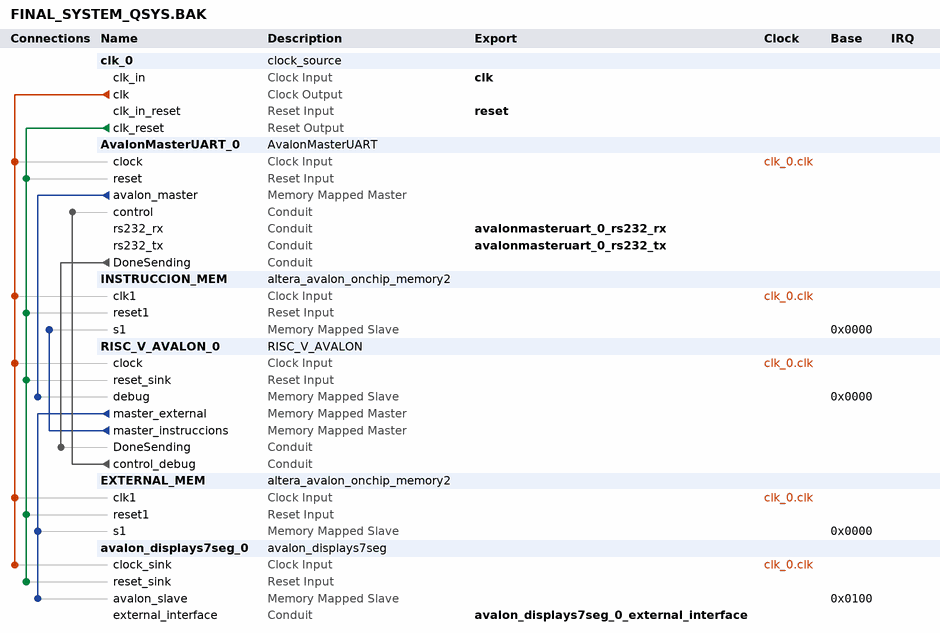
[diagram p0: system contents]
# Platform Designer (Qsys) system FINAL_SYSTEM_QSYS.BAK, Cyclone IV E EP4CE115F29C7
# Parameters at their usual value, and those the tool derives, are not listed.
package require -exact qsys 17.1
create_system FINAL_SYSTEM_QSYS.BAK
set_project_property DEVICE_FAMILY {Cyclone IV E}
set_project_property DEVICE EP4CE115F29C7

add_instance clk_0 clock_source 17.1
set_instance_parameter_value clk_0 clockFrequency 50000000

add_instance AvalonMasterUART_0 AvalonMasterUART 3.0
set_instance_parameter_value AvalonMasterUART_0 c_CLKS_PER_BIT 434

add_instance INSTRUCCION_MEM altera_avalon_onchip_memory2 17.1
set_instance_parameter_value INSTRUCCION_MEM dataWidth 32
set_instance_parameter_value INSTRUCCION_MEM dualPort false
set_instance_parameter_value INSTRUCCION_MEM initMemContent true
set_instance_parameter_value INSTRUCCION_MEM initializationFileName onchip_mem.hex
set_instance_parameter_value INSTRUCCION_MEM memorySize 256

add_instance RISC_V_AVALON_0 RISC_V_AVALON 3.0

add_instance EXTERNAL_MEM altera_avalon_onchip_memory2 17.1
set_instance_parameter_value EXTERNAL_MEM dataWidth 32
set_instance_parameter_value EXTERNAL_MEM dualPort false
set_instance_parameter_value EXTERNAL_MEM initMemContent true
set_instance_parameter_value EXTERNAL_MEM initializationFileName onchip_mem.hex
set_instance_parameter_value EXTERNAL_MEM memorySize 256

add_instance avalon_displays7seg_0 avalon_displays7seg 1.0
set_instance_parameter_value avalon_displays7seg_0 invert 0

# connections
add_connection clk_0.clk avalon_displays7seg_0.clock_sink clock
add_connection clk_0.clk AvalonMasterUART_0.clock clock
add_connection clk_0.clk EXTERNAL_MEM.clk1 clock
add_connection clk_0.clk INSTRUCCION_MEM.clk1 clock
add_connection clk_0.clk RISC_V_AVALON_0.clock clock
add_connection clk_0.clk_reset avalon_displays7seg_0.reset_sink reset
add_connection clk_0.clk_reset AvalonMasterUART_0.reset reset
add_connection clk_0.clk_reset EXTERNAL_MEM.reset1 reset
add_connection clk_0.clk_reset INSTRUCCION_MEM.reset1 reset
add_connection clk_0.clk_reset RISC_V_AVALON_0.reset_sink reset
add_connection AvalonMasterUART_0.avalon_master RISC_V_AVALON_0.debug avalon
set_connection_parameter_value AvalonMasterUART_0.avalon_master/RISC_V_AVALON_0.debug baseAddress 0x0000
add_connection RISC_V_AVALON_0.master_external avalon_displays7seg_0.avalon_slave avalon
set_connection_parameter_value RISC_V_AVALON_0.master_external/avalon_displays7seg_0.avalon_slave baseAddress 0x0100
add_connection RISC_V_AVALON_0.master_external EXTERNAL_MEM.s1 avalon
set_connection_parameter_value RISC_V_AVALON_0.master_external/EXTERNAL_MEM.s1 baseAddress 0x0000
add_connection RISC_V_AVALON_0.master_instruccions INSTRUCCION_MEM.s1 avalon
set_connection_parameter_value RISC_V_AVALON_0.master_instruccions/INSTRUCCION_MEM.s1 baseAddress 0x0000
add_connection AvalonMasterUART_0.DoneSending RISC_V_AVALON_0.DoneSending conduit
add_connection RISC_V_AVALON_0.control_debug AvalonMasterUART_0.control conduit

# exported interfaces
add_interface avalon_displays7seg_0_external_interface conduit end
set_interface_property avalon_displays7seg_0_external_interface EXPORT_OF avalon_displays7seg_0.external_interface
add_interface avalonmasteruart_0_rs232_rx conduit end
set_interface_property avalonmasteruart_0_rs232_rx EXPORT_OF AvalonMasterUART_0.rs232_rx
add_interface avalonmasteruart_0_rs232_tx conduit end
set_interface_property avalonmasteruart_0_rs232_tx EXPORT_OF AvalonMasterUART_0.rs232_tx
add_interface clk clock sink
set_interface_property clk EXPORT_OF clk_0.clk_in
add_interface reset reset sink
set_interface_property reset EXPORT_OF clk_0.clk_in_reset

set_interconnect_requirement {$system} qsys_mm.clockCrossingAdapter HANDSHAKE
set_interconnect_requirement {$system} qsys_mm.enableEccProtection FALSE
set_interconnect_requirement {$system} qsys_mm.insertDefaultSlave FALSE
set_interconnect_requirement {$system} qsys_mm.maxAdditionalLatency 1

save_system FINAL_SYSTEM_QSYS.BAK.qsys
